# Altium schematic sheet Ch7and8.SchDoc
size A
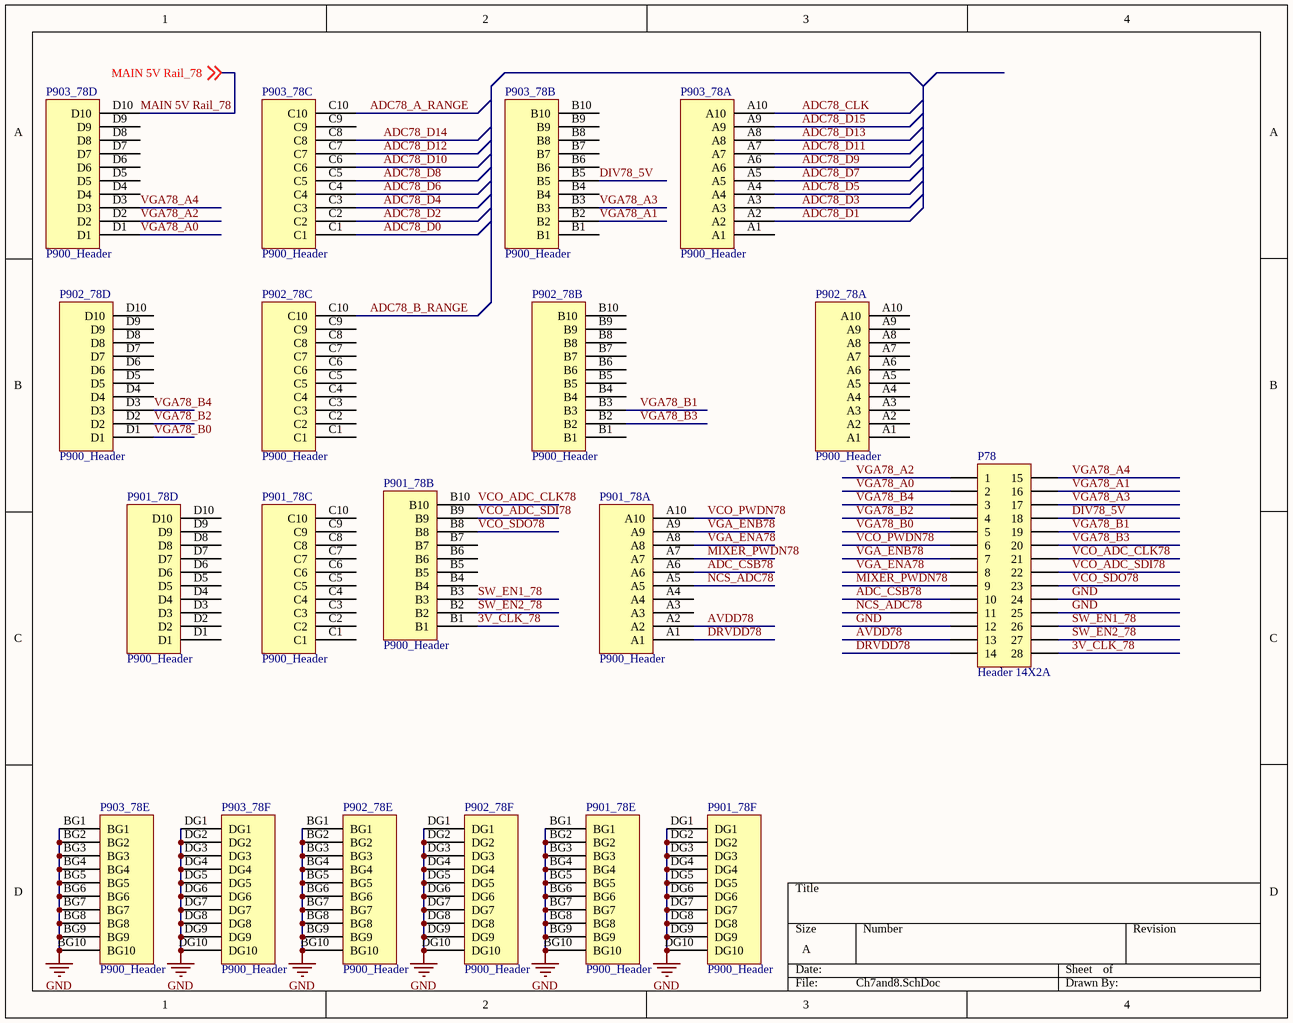
[diagram p0: Ch7and8.SchDoc]

## Parts
P78  Header 14X2A  [HDR2X14_CEN]
P901_78  P900_Header  [P900_header]  (parts A,B,C,D,E,F of 6)
P902_78  P900_Header  [P900_header]  (parts A,B,C,D,E,F of 6)
P903_78  P900_Header  [P900_header]  (parts A,B,C,D,E,F of 6)

## Nets
GND: P78.12 P78.24 P78.25 P901_78.BG1 P901_78.BG2 P901_78.BG3 P901_78.BG4 P901_78.BG5 P901_78.BG6 P901_78.BG7 P901_78.BG8 P901_78.BG9 P901_78.BG10 P901_78.DG1 P901_78.DG2 P901_78.DG3 P901_78.DG4 P901_78.DG5 P901_78.DG6 P901_78.DG7 P901_78.DG8 P901_78.DG9 P901_78.DG10 P902_78.BG1 P902_78.BG2 P902_78.BG3 P902_78.BG4 P902_78.BG5 P902_78.BG6 P902_78.BG7 P902_78.BG8 P902_78.BG9 P902_78.BG10 P902_78.DG1 P902_78.DG2 P902_78.DG3 P902_78.DG4 P902_78.DG5 P902_78.DG6 P902_78.DG7 P902_78.DG8 P902_78.DG9 P902_78.DG10 P903_78.BG1 P903_78.BG2 P903_78.BG3 P903_78.BG4 P903_78.BG5 P903_78.BG6 P903_78.BG7 P903_78.BG8 P903_78.BG9 P903_78.BG10 P903_78.DG1 P903_78.DG2 P903_78.DG3 P903_78.DG4 P903_78.DG5 P903_78.DG6 P903_78.DG7 P903_78.DG8 P903_78.DG9 P903_78.DG10
3V_CLK_78: P78.28 P901_78.B1
ADC78_A_RANGE: P903_78.C10
ADC78_B_RANGE: P902_78.C10
ADC78_CLK: P903_78.A10
ADC78_D0: P903_78.C1
ADC78_D1: P903_78.A2
ADC78_D2: P903_78.C2
ADC78_D3: P903_78.A3
ADC78_D4: P903_78.C3
ADC78_D5: P903_78.A4
ADC78_D6: P903_78.C4
ADC78_D7: P903_78.A5
ADC78_D8: P903_78.C5
ADC78_D9: P903_78.A6
ADC78_D10: P903_78.C6
ADC78_D11: P903_78.A7
ADC78_D12: P903_78.C7
ADC78_D13: P903_78.A8
ADC78_D14: P903_78.C8
ADC78_D15: P903_78.A9
ADC_CSB78: P78.10 P901_78.A6
AVDD78: P78.13 P901_78.A2
DIV78_5V: P78.18 P903_78.B5
DRVDD78: P78.14 P901_78.A1
MAIN 5V Rail_78: P903_78.D10 ; off-sheet MAIN 5V Rail_78
MIXER_PWDN78: P78.9 P901_78.A7
NCS_ADC78: P78.11 P901_78.A5
SW_EN1_78: P78.26 P901_78.B3
SW_EN2_78: P78.27 P901_78.B2
VCO_ADC_CLK78: P78.21 P901_78.B10
VCO_ADC_SDI78: P78.22 P901_78.B9
VCO_PWDN78: P78.6 P901_78.A10
VCO_SDO78: P78.23 P901_78.B8
VGA78_A0: P78.2 P903_78.D1
VGA78_A1: P78.16 P903_78.B2
VGA78_A2: P78.1 P903_78.D2
VGA78_A3: P78.17 P903_78.B3
VGA78_A4: P78.15 P903_78.D3
VGA78_B0: P78.5 P902_78.D1
VGA78_B1: P78.19 P902_78.B3
VGA78_B2: P78.4 P902_78.D2
VGA78_B3: P78.20 P902_78.B2
VGA78_B4: P78.3 P902_78.D3
VGA_ENA78: P78.8 P901_78.A8
VGA_ENB78: P78.7 P901_78.A9

Not connected (* = marked no-connect by the designer): P901_78 A3 A4 B4 B5 B6 B7 C1 C2 C3 C4 C5 C6 C7 C8 C9 C10 D1 D2 D3 D4 D5 D6 D7 D8 D9 D10; P902_78 A1 A2 A3 A4 A5 A6 A7 A8 A9 A10 B1 B4 B5 B6 B7 B8 B9 B10 C1 C2 C3 C4 C5 C6 C7 C8 C9 D4 D5 D6 D7 D8 D9 D10; P903_78 A1 B1 B4 B6 B7 B8 B9 B10 C9 D4 D5 D6 D7 D8 D9

## Library data of the parts
P78 = Header 14X2A: Header, 14-Pin, Dual row; LatestRevisionDate: 17-Jul-2002; LatestRevisionNote: Re-released for DXP Platform.; Publisher: Altium Limited
P902_78 P903_78 = P900_Header: pin to pad: A1>ADC